# EAGLE design midipult-nomatrix (EAGLE 4.15)
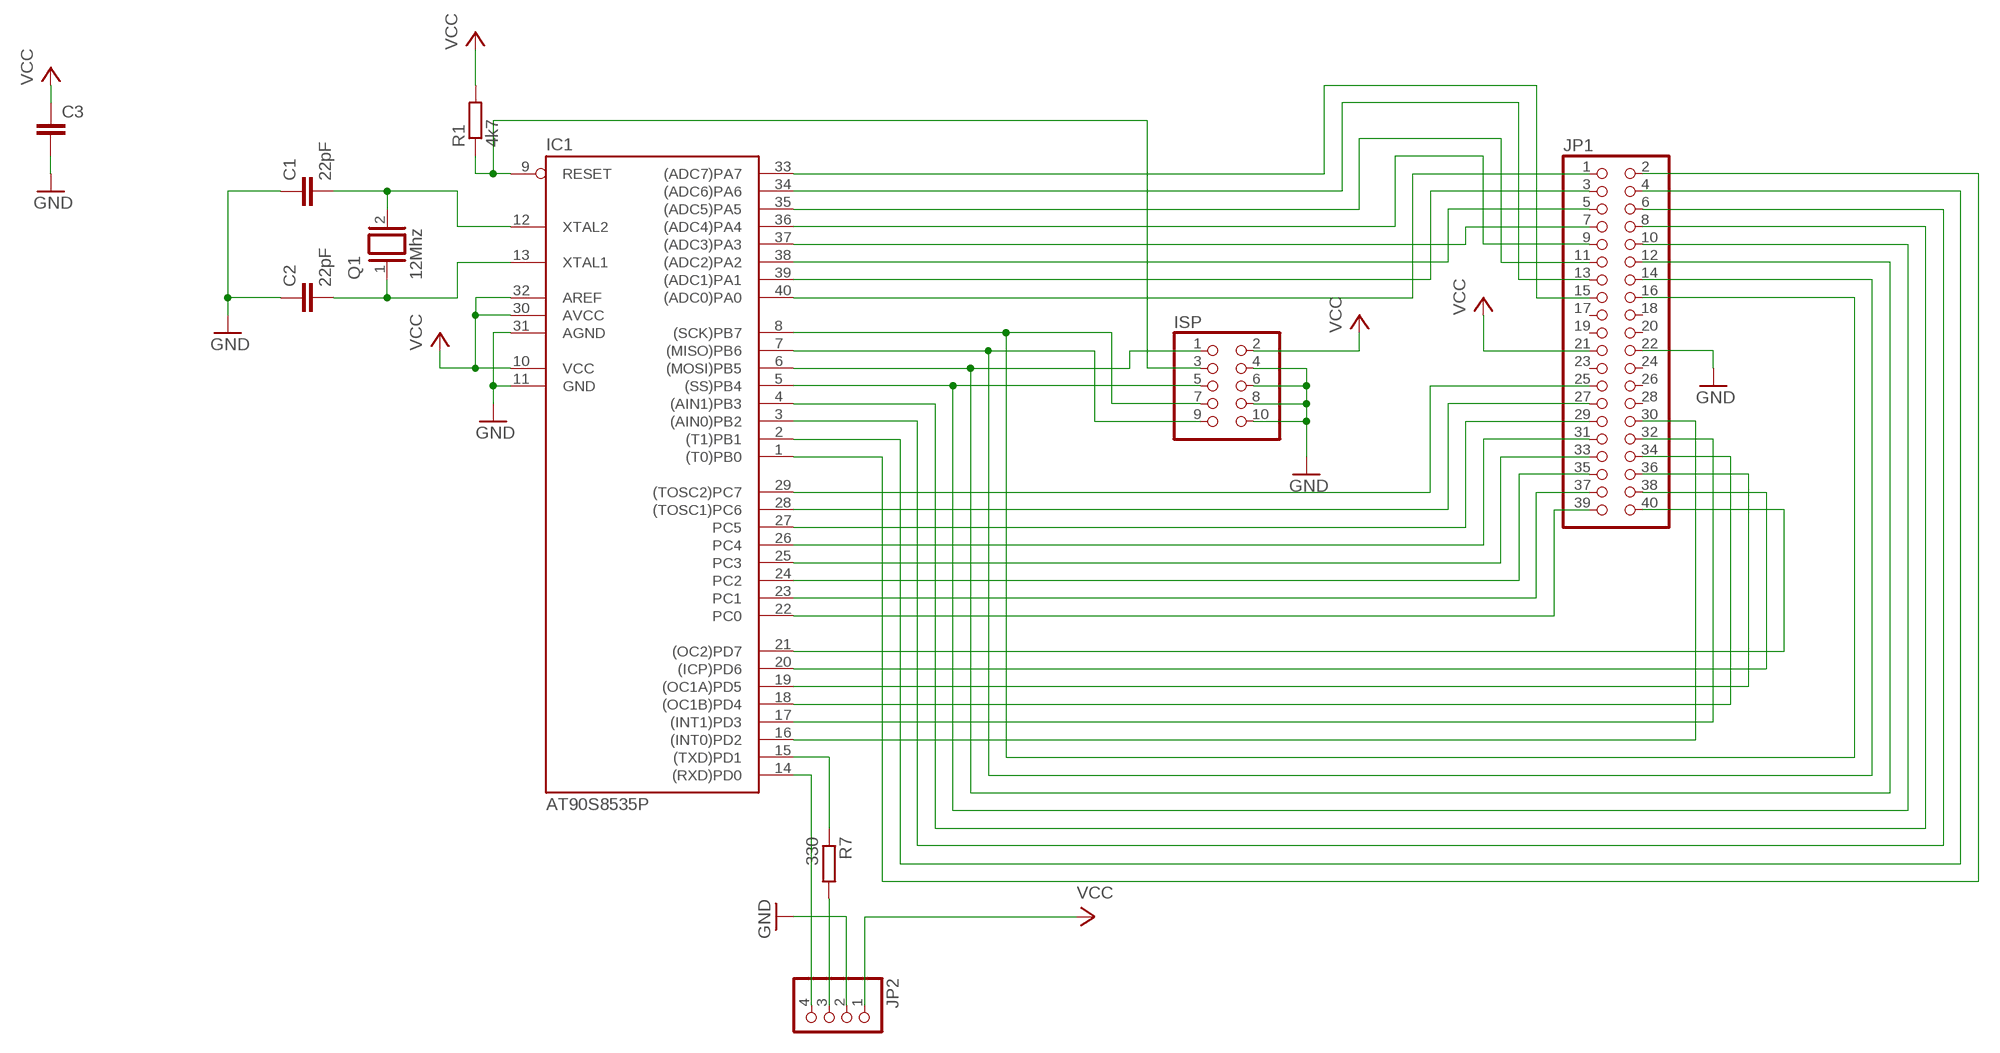
[diagram p0: schematic, sheet 1]

## Parts
C1  22pF  C-EU025-050X050  [C025-050X050]
C2  22pF  C-EU025-050X050  [C025-050X050]
C3  C-EU025-050X050  [C025-050X050]
IC1  AT90S8535P  [DIL40]
ISP  PINHD-2X5  [2X05]
JP1  PINHD-2X20  [2X20]
JP2  PINHD-1X4  [1X04]
Q1  12Mhz  XTAL  [Q]
R1  4k7  R-EU_0204/7  [0204/7]
R7  330  R-EU_0207/10  [0207/10]

## Nets
GND: C1.1 C2.1 C3.2 IC1.11(GND) IC1.31(AGND) ISP.4 ISP.6 ISP.8 ISP.10 JP1.22 JP2.2
ISP: IC1.6((MOSI)PB5) ISP.1 JP1.12
N$1: IC1.24(PC2) JP1.35
N$2: IC1.40((ADC0)PA0) JP1.1
N$3: IC1.39((ADC1)PA1) JP1.3
N$4: IC1.15((TXD)PD1) R7.1
N$5: IC1.16((INT0)PD2) JP1.30
N$6: IC1.17((INT1)PD3) JP1.32
N$7: IC1.18((OC1B)PD4) JP1.34
N$8: C2.2 IC1.13(XTAL1) Q1.1
N$9: C1.2 IC1.12(XTAL2) Q1.2
N$10: JP2.3 R7.2
N$11: IC1.19((OC1A)PD5) JP1.36
N$12: IC1.20((ICP)PD6) JP1.38
N$13: IC1.9(RESET) ISP.3 R1.1
N$14: IC1.21((OC2)PD7) JP1.40
N$15: IC1.25(PC3) JP1.33
N$16: IC1.26(PC4) JP1.31
N$17: IC1.23(PC1) JP1.37
N$18: IC1.22(PC0) JP1.39
N$19: IC1.1((T0)PB0) JP1.2
N$20: IC1.27(PC5) JP1.29
N$21: IC1.28((TOSC1)PC6) JP1.27
N$22: IC1.29((TOSC2)PC7) JP1.25
N$23: IC1.14((RXD)PD0) JP2.4
N$72: IC1.2((T1)PB1) JP1.4
N$73: IC1.3((AIN0)PB2) JP1.6
N$74: IC1.4((AIN1)PB3) JP1.8
N$75: IC1.5((SS)PB4) ISP.5 JP1.10
N$77: IC1.7((MISO)PB6) ISP.9 JP1.14
N$78: IC1.8((SCK)PB7) ISP.7 JP1.16
N$81: IC1.38((ADC2)PA2) JP1.5
N$82: IC1.37((ADC3)PA3) JP1.7
N$83: IC1.36((ADC4)PA4) JP1.9
N$84: IC1.35((ADC5)PA5) JP1.11
N$85: IC1.34((ADC6)PA6) JP1.13
N$86: IC1.33((ADC7)PA7) JP1.15
VCC: C3.1 IC1.10(VCC) IC1.30(AVCC) IC1.32(AREF) ISP.2 JP1.21 JP2.1 R1.2
Unconnected: JP1.17 JP1.18 JP1.19 JP1.20 JP1.23 JP1.24 JP1.26 JP1.28

## Library data of the parts
C1-C3 = rcl:C-EU: CAPACITOR, European symbol
IC1 = atmel:AT90*8535P: MICROCONTROLLER 8 Kbytes FLASH 512 bytes SRAM 512 bytes EEPROM UART 8-channel 10 bit ADC
ISP = pinhead:PINHD-2X5: PIN HEADER
JP1 = pinhead:PINHD-2X20: PIN HEADER
JP2 = pinhead:PINHD-1X4: PIN HEADER
Q1 = special:XTAL: CRYSTAL
R1 R7 = rcl:R-EU_: RESISTOR, European symbol

## Board
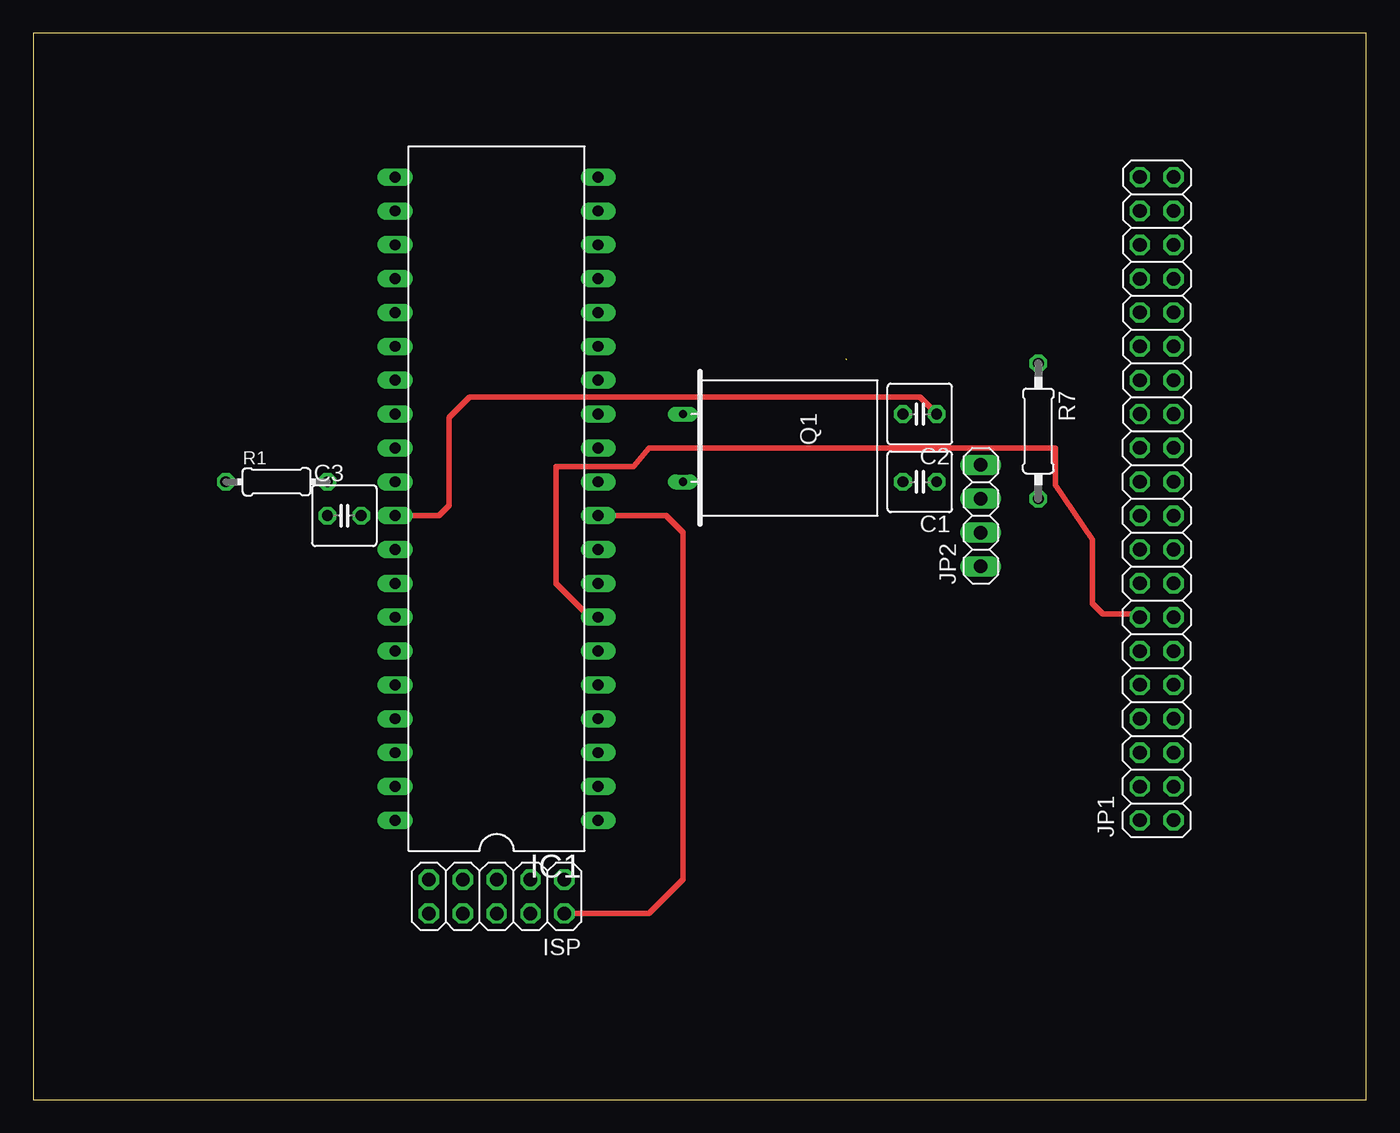
[diagram p1: board, top side]
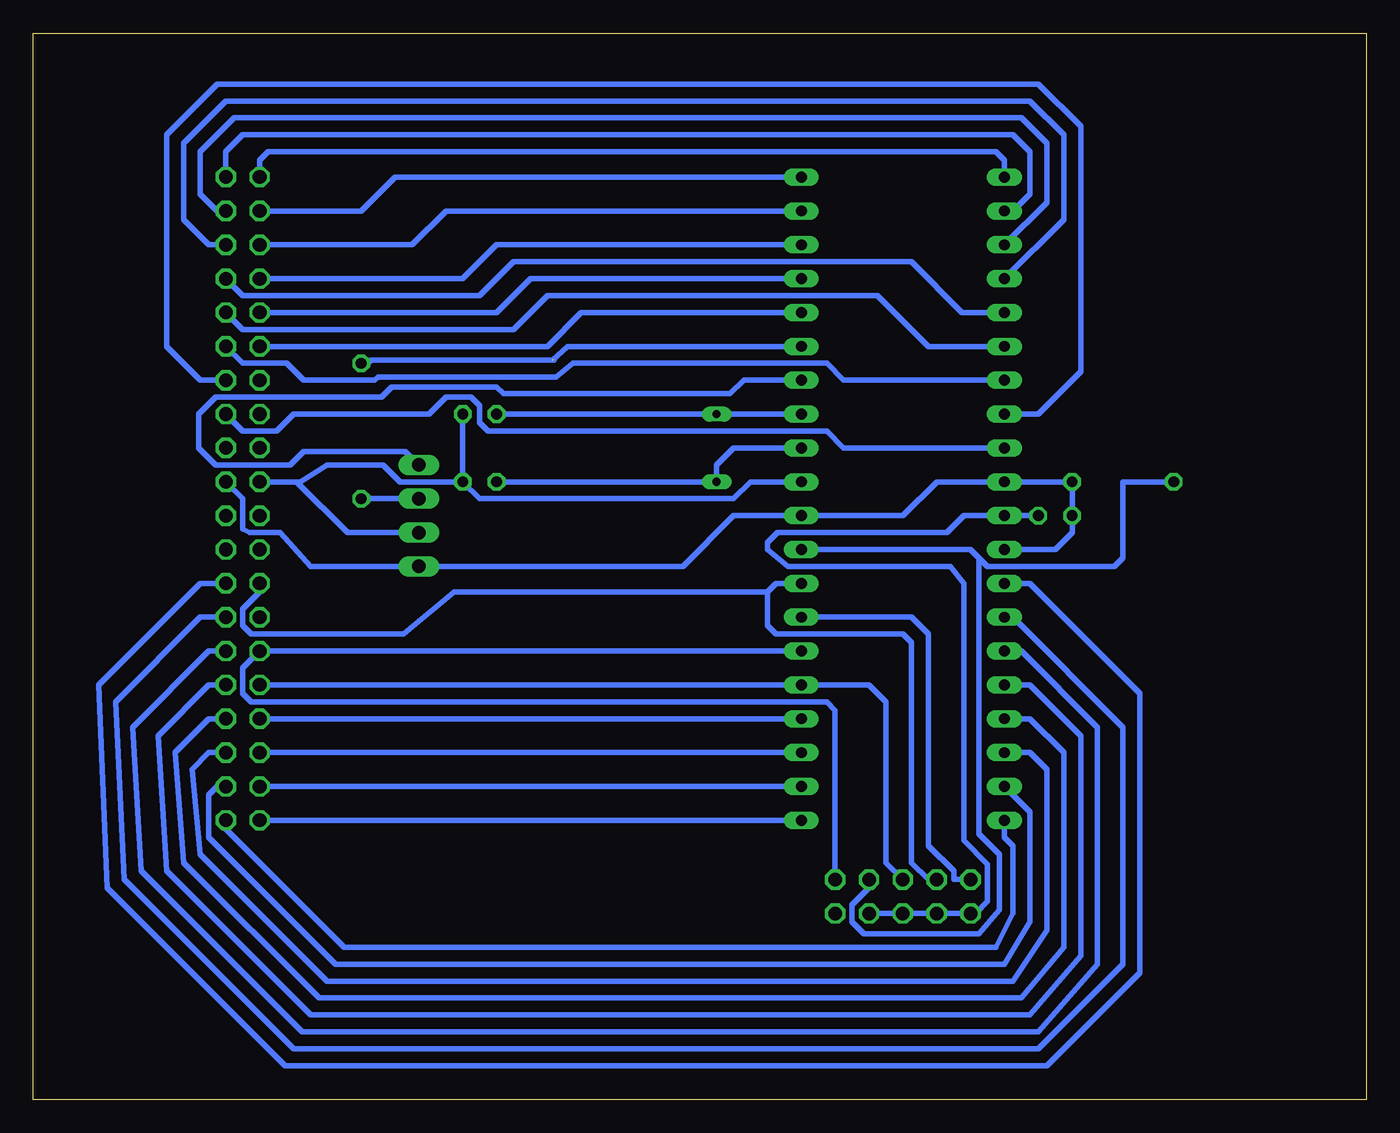
[diagram p2: board, bottom side, seen from below]

Size 100 x 80 mm. Coordinates in mm from the lower left corner, seen from the top.
Outline: 0,0 100,0 100,80 0,80 0,0
Copper layers 1*16: Top 0.035mm / dielectric 1.5mm / Bottom 0.035mm
Design rules "default": minimum track width 10mil, minimum drill 24mil, track to track 10mil, track to pad 10mil, pad to pad 10mil, via to via 10mil, smd to smd 10mil, copper to edge 40mil, drill to drill 8mil, minimum pad ring 10mil, minimum via ring 8mil, stop-mask expansion 4mil, vias tented up to drill 0mil, thermal gap 10mil

### Footprints (pad centres in the part's own frame; a part is rotated, then mirrored left to right if it is on the bottom)
C025-050X050 = drill 0.813 octagon: 1 -1.27,0; 2 1.27,0
DIL40 = drill 0.813 long: 1 -24.13,-7.62; 2 -21.59,-7.62; 3 -19.05,-7.62; 4 -16.51,-7.62; 5 -13.97,-7.62; 6 -11.43,-7.62; 7 -8.89,-7.62; 8 -6.35,-7.62; 9 -3.81,-7.62; 10 -1.27,-7.62; 11 1.27,-7.62; 12 3.81,-7.62; 13 6.35,-7.62; 14 8.89,-7.62; 15 11.43,-7.62; 16 13.97,-7.62; 17 16.51,-7.62; 18 19.05,-7.62; 19 21.59,-7.62; 20 24.13,-7.62; 21 24.13,7.62; 22 21.59,7.62; 23 19.05,7.62; 24 16.51,7.62; 25 13.97,7.62; 26 11.43,7.62; 27 8.89,7.62; 28 6.35,7.62; 29 3.81,7.62; 30 1.27,7.62; 31 -1.27,7.62; 32 -3.81,7.62; 33 -6.35,7.62; 34 -8.89,7.62; 35 -11.43,7.62; 36 -13.97,7.62; 37 -16.51,7.62; 38 -19.05,7.62; 39 -21.59,7.62; 40 -24.13,7.62
2X05 = drill 1.016 octagon: 1 -5.08,-1.27; 2 -5.08,1.27; 3 -2.54,-1.27; 4 -2.54,1.27; 5 0,-1.27; 6 0,1.27; 7 2.54,-1.27; 8 2.54,1.27; 9 5.08,-1.27; 10 5.08,1.27
2X20 = drill 1.016 octagon: 1 -24.13,-1.27; 2 -24.13,1.27; 3 -21.59,-1.27; 4 -21.59,1.27; 5 -19.05,-1.27; 6 -19.05,1.27; 7 -16.51,-1.27; 8 -16.51,1.27; 9 -13.97,-1.27; 10 -13.97,1.27; 11 -11.43,-1.27; 12 -11.43,1.27; 13 -8.89,-1.27; 14 -8.89,1.27; 15 -6.35,-1.27; 16 -6.35,1.27; 17 -3.81,-1.27; 18 -3.81,1.27; 19 -1.27,-1.27; 20 -1.27,1.27; 21 1.27,-1.27; 22 1.27,1.27; 23 3.81,-1.27; 24 3.81,1.27; 25 6.35,-1.27; 26 6.35,1.27; 27 8.89,-1.27; 28 8.89,1.27; 29 11.43,-1.27; 30 11.43,1.27; 31 13.97,-1.27; 32 13.97,1.27; 33 16.51,-1.27; 34 16.51,1.27; 35 19.05,-1.27; 36 19.05,1.27; 37 21.59,-1.27; 38 21.59,1.27; 39 24.13,-1.27; 40 24.13,1.27
1X04 = drill 1.016 long: 1 -3.81,0; 2 -1.27,0; 3 1.27,0; 4 3.81,0
Q = drill 0.61 long: 1 -2.54,-7.62; 2 2.54,-7.62
0204/7 = drill 0.813 octagon: 1 -3.81,0; 2 3.81,0
0207/10 = drill 0.813 octagon: 1 -5.08,0; 2 5.08,0

### Placement (x,y rotation side)
C1  66.51,46.35 180 top
C2  66.51,51.43 180 top
C3  23.33,43.81 0 top
IC1  34.76,45.08 90 top
ISP  34.76,15.24 180 top
JP1  84.29,45.08 90 top
JP2  71.08,43.81 90 top
Q1  56.35,48.89 270 top
R1  18.25,46.35 0 top
R7  75.4,50.16 270 top

### Tracks (layer width: path | path; a pad name or v marks a point on that pad's centre or on a via)
GND
  Top 0.406: IC1.31 30.44,43.81 31.2,44.57 31.2,51.18 32.73,52.7 66.51,52.7 C2.1
  Bottom 0.406: C2.1 C1.1 | 26.89,43.81 C3.2 | ISP.4 ISP.6 ISP.8 ISP.10 29.3,13.97 28.41,14.85 28.41,17.65 30.19,19.43 30.19,38.73 31.2,40 43.4,40 44.92,41.27 44.92,41.78 44.16,42.54 31.46,42.54 30.19,43.81 26.89,43.81 | C1.1 72.48,46.35 73.75,47.62 77.94,47.62 79.97,46.35 JP1.22 80.23,46.35 76.42,42.54 JP2.2 | IC1.11 46.19,46.35 47.46,45.08 66.51,45.08 C1.1 | 26.89,43.81 IC1.31
ISP
  Bottom 0.406: IC1.6 JP1.12 84.29,32.38 84.29,30.47 83.66,29.84 40.48,29.84 39.84,29.2 ISP.1
N$1
  Bottom 0.406: IC1.24 22.7,66.03 22.7,72.38 25.23,74.92 85.56,74.92 88.73,71.75 88.73,66.03 86.83,64.13 JP1.35
N$2
  Bottom 0.406: IC1.40 27.14,19.68 26.5,19.04 26.5,13.97 27.77,11.43 76.67,11.43 85.56,20.31 JP1.1
N$3
  Bottom 0.406: IC1.39 25.23,21.58 25.23,13.33 27.14,10.16 77.3,10.16 86.83,19.68 86.83,22.86 86.19,23.49 JP1.3
N$4  (1 unrouted)
  Bottom 0.406: 61.05,55.49 59.91,56.51 IC1.15 | R7.1 74.89,55.24 74.64,55.49 60.92,55.49 60.98,55.55 60.98,55.56
N$5
  Bottom 0.406: IC1.16 58.89,59.05 61.43,56.51 JP1.30
N$6
  Bottom 0.406: IC1.17 62.7,61.59 65.24,59.05 JP1.32
N$7
  Bottom 0.406: IC1.18 65.24,64.13 67.78,61.59 JP1.34
N$8
  Bottom 0.406: IC1.13 Q1.1 C2.2
N$9
  Bottom 0.406: IC1.12 47.46,48.89 48.73,47.62 Q1.2 C1.2
N$10
  Bottom 0.406: 75.65,45.08 R7.2 JP2.3
N$11
  Bottom 0.406: IC1.19 69.05,66.67 71.59,64.13 JP1.36
N$12
  Bottom 0.406: IC1.20 72.86,69.21 75.4,66.67 JP1.38
N$13
  Bottom 0.406: R1.1 18.25,46.35 18.25,40.64 18.88,40 28.41,40 29.04,40.64 | 29.04,40.64 29.68,41.27 IC1.9 | ISP.3 37.3,15.87 38.57,14.6 38.57,13.33 37.68,12.44 29.04,12.44 27.52,14.22 27.52,18.41 29.04,19.93 29.04,40.64
N$14
  Bottom 0.406: IC1.21 27.14,70.48 27.77,71.11 82.39,71.11 83.02,70.48 JP1.40
N$15
  Bottom 0.406: IC1.25 30.31,59.05 34.12,62.86 63.97,62.86 66.51,60.32 84.29,60.32 JP1.33
N$16
  Bottom 0.406: IC1.26 32.85,56.51 36.66,60.32 61.43,60.32 63.97,57.78 84.29,57.78 JP1.31
N$17
  Bottom 0.406: IC1.23 23.96,67.3 23.96,71.75 25.87,73.66 84.92,73.66 87.47,71.11 87.47,67.94 86.19,66.67 JP1.37
N$18
  Bottom 0.406: IC1.22 26.5,66.67 25.23,67.94 25.23,71.11 26.5,72.38 84.29,72.38 85.56,71.11 JP1.39
N$19
  Bottom 0.406: JP1.2 IC1.1
N$20
  Bottom 0.406: IC1.27 39.2,53.97 40.48,55.24 59.52,55.24 60.8,54.22 74.13,54.22 74.38,53.97 79.72,53.97 80.99,55.24 81.24,55.24 84.29,55.24 JP1.29
N$21
  Bottom 0.406: IC1.28 24.6,51.43 21.42,54.61 21.42,73.02 24.6,76.19 86.19,76.19 90,72.38 90,56.51 87.47,53.97 JP1.27
N$22
  Bottom 0.406: IC1.29 39.2,48.89 40.48,50.16 65.88,50.16 66.51,50.8 66.51,52.07 67.14,52.7 69.05,52.7 70.32,51.43 80.48,51.43 81.75,50.16 84.29,50.16 JP1.25
N$23
  Bottom 0.406: IC1.14 46.7,53.97 47.71,52.95 64.73,52.95 65.24,53.46 73.11,53.46 73.88,52.7 86.32,52.7 87.59,51.43 87.59,48.89 86.32,47.62 80.73,47.62 79.72,48.64 72.1,48.64 JP2.4
N$72
  Bottom 0.406: JP1.4 IC1.2
N$73
  Bottom 0.406: JP1.6 IC1.3
N$74
  Bottom 0.406: JP1.8 IC1.4
N$75
  Bottom 0.406: JP1.10 IC1.5 37.3,31.11 36.03,29.84 36.03,17.77 ISP.5
N$77
  Top 0.406: IC1.7 41.74,36.19 39.2,38.73 39.2,47.49 45.05,47.49 46.19,48.89 76.67,48.89 76.67,46.1 79.46,42.03 79.46,37.21 80.23,36.44 82.77,36.44 JP1.14
  Bottom 0.406: ISP.9 30.95,16.5 30.95,17.14 32.85,19.04 32.85,34.92 34.12,36.19 IC1.7
N$78
  Bottom 0.406: 44.92,38.1 44.92,35.55 44.28,34.92 34.76,34.92 34.12,34.29 34.12,17.77 32.85,16.5 ISP.7 | 44.92,38.1 44.28,38.73 IC1.8 | JP1.16 83.02,38.1 84.29,36.83 84.29,35.55 83.66,34.92 72.22,34.92 68.41,38.1 44.92,38.1
N$81
  Bottom 0.406: JP1.5 86.83,26.03 88.1,24.76 87.47,18.41 77.94,8.89 26.5,8.89 23.96,12.7 23.96,24.76 25.23,26.03 IC1.38
N$82
  Bottom 0.406: IC1.37 25.23,28.57 22.7,26.03 22.7,11.43 25.87,7.62 78.58,7.62 88.73,17.77 89.37,26.03 86.83,28.57 JP1.7
N$83
  Bottom 0.406: JP1.9 86.83,31.11 90.64,27.3 90,17.14 79.21,6.34 25.23,6.34 21.42,10.79 21.42,27.3 25.23,31.11 IC1.36
N$84
  Bottom 0.406: IC1.35 25.87,33.65 20.15,27.93 20.15,10.16 24.6,5.08 79.84,5.08 91.91,17.14 92.55,27.93 86.83,33.65 JP1.11
N$85
  Bottom 0.406: IC1.34 26.5,36.19 18.25,27.93 18.25,10.16 24.6,3.8 80.48,3.8 93.18,16.5 93.81,29.84 87.47,36.19 JP1.13
N$86
  Bottom 0.406: JP1.15 87.47,38.73 95.08,31.11 94.45,15.87 81.11,2.54 23.96,2.54 16.98,9.52 16.98,30.47 25.23,38.73 IC1.33
VCC
  Top 0.406: ISP.2 46.19,13.97 48.73,16.5 48.73,42.54 47.46,43.81 IC1.10
  Bottom 0.406: IC1.32 23.33,41.27 22.06,42.54 C3.1 R1.2 IC1.30 32.22,46.35 34.76,43.81 42.13,43.81 | 42.13,43.81 42.38,43.56 IC1.10 42.13,43.81 | JP1.21 84.29,45.08 84.29,42.79 83.78,42.54 81.5,42.54 79.21,40 JP2.1 51.27,40 47.46,43.81 42.13,43.81